# Altium schematic sheet DC_IN.SchDoc
size B
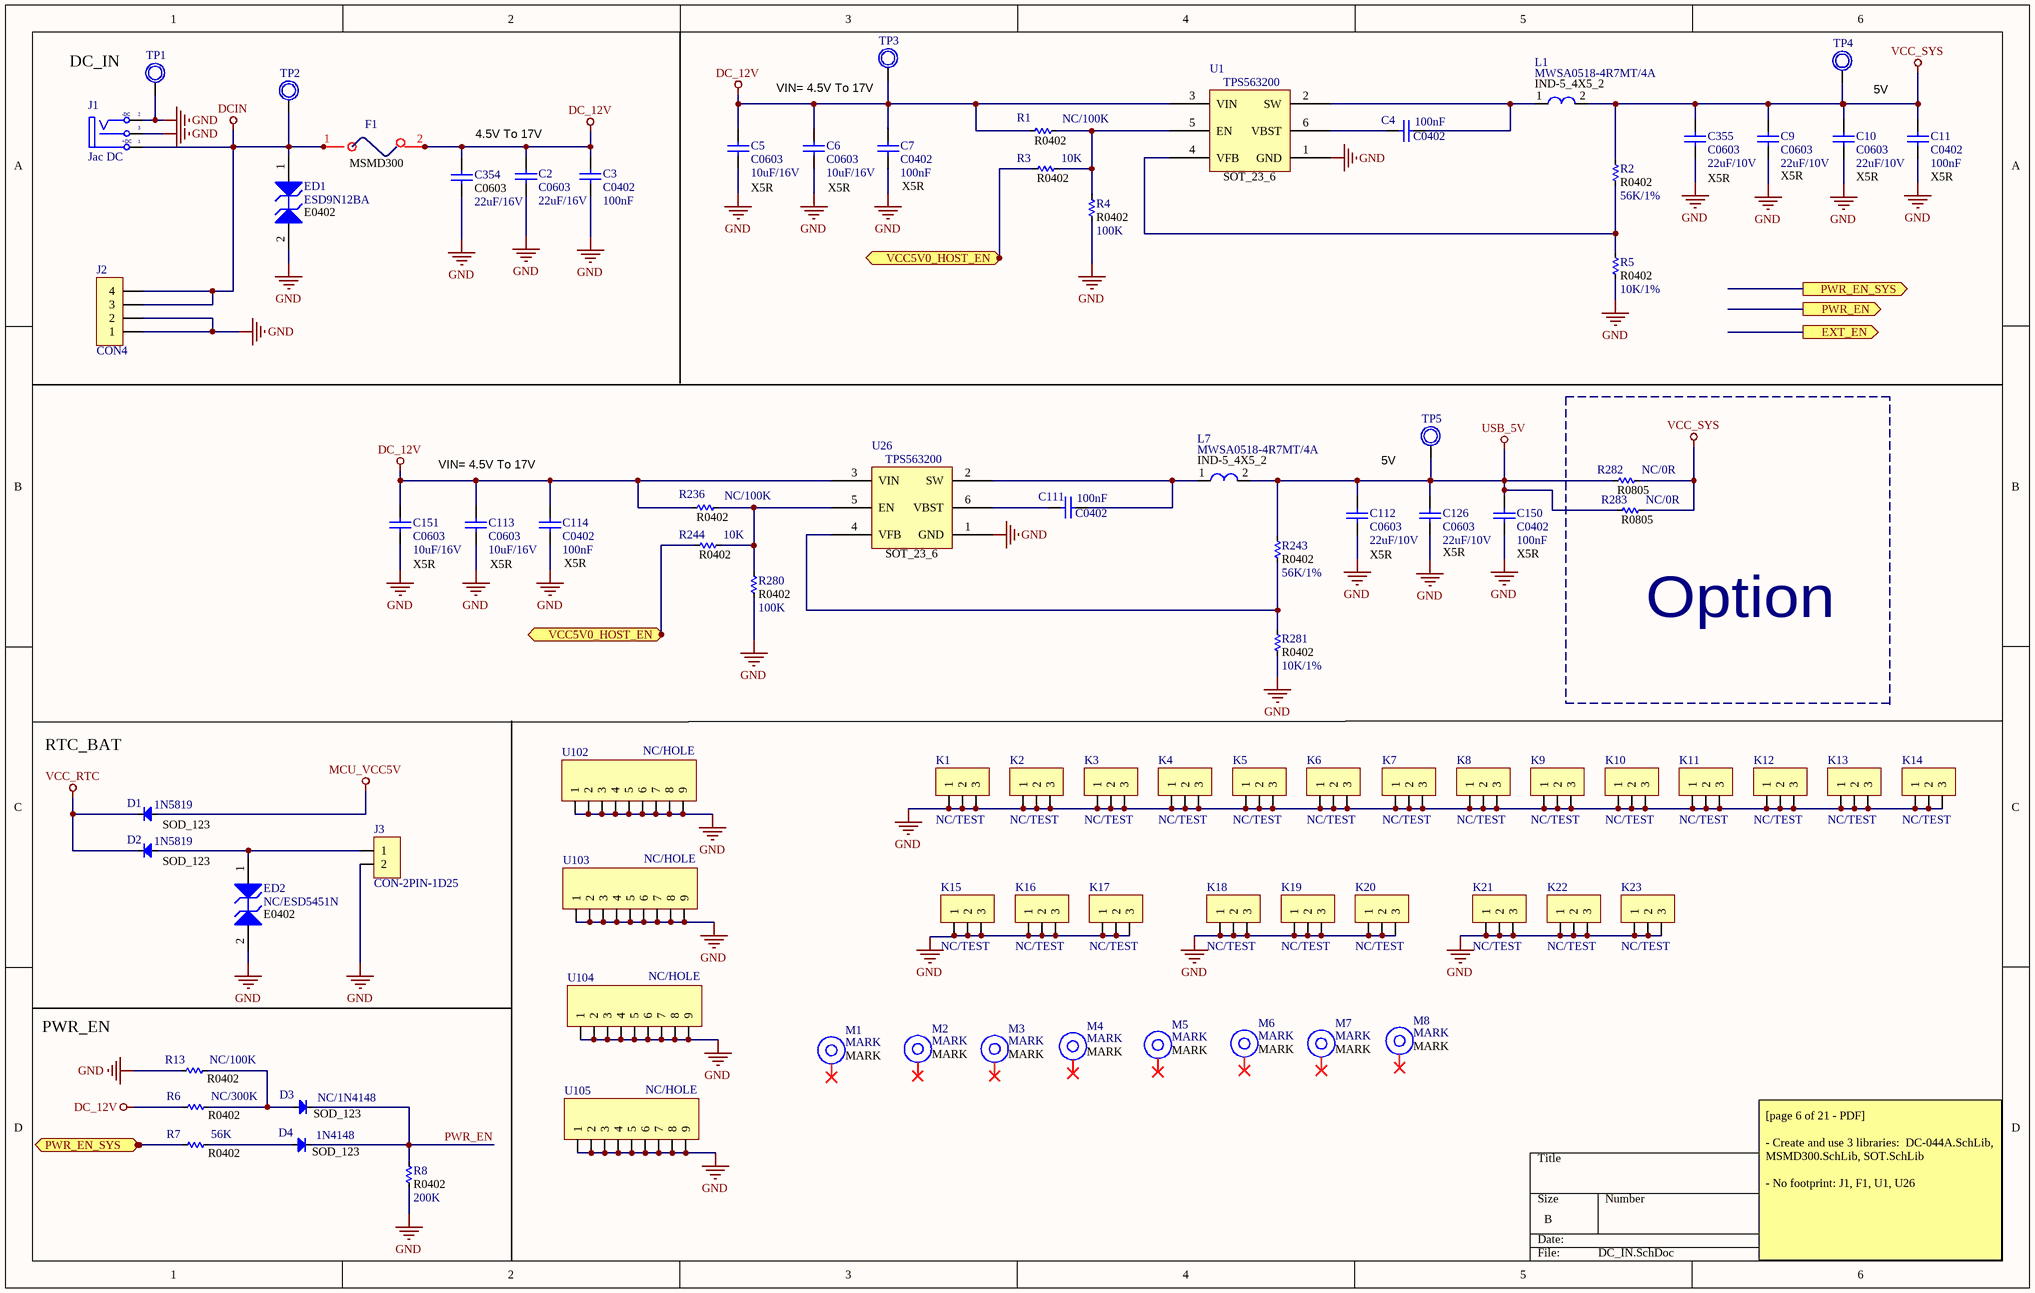
[diagram p0: DC_IN.SchDoc]

## Parts
C2  C0603  value 22uF/16V  [C 0603]
C3  C0402  value 100nF  [C 0402]
C4  C0402  value 100nF  [C 0402]
C5  C0603  value 10uF/16V  [C 0603]
C6  C0603  value 10uF/16V  [C 0603]
C7  C0402  value 100nF  [C 0402]
C9  C0603  value 22uF/10V  [C 0603]
C10  C0603  value 22uF/10V  [C 0603]
C11  C0402  value 100nF  [C 0402]
C111  C0402  value 100nF  [C 0402]
C112  C0603  value 22uF/10V  [C 0603]
C113  C0603  value 10uF/16V  [C 0603]
C114  C0402  value 100nF  [C 0402]
C126  C0603  value 22uF/10V  [C 0603]
C150  C0402  value 100nF  [C 0402]
C151  C0603  value 10uF/16V  [C 0603]
C354  C0603  value 22uF/16V  [C 0603]
C355  C0603  value 22uF/10V  [C 0603]
D1  value 1N5819  typr: SOD_123  [DIO-SMD-123]  (hidden comment: Diode SMD)
D2  value 1N5819  typr: SOD_123  [DIO-SMD-123]  (hidden comment: Diode SMD)
D3  value NC/1N4148  typr: SOD_123  [DIO-SMD-123]  (hidden comment: Diode SMD)
D4  value 1N4148  typr: SOD_123  [DIO-SMD-123]  (hidden comment: Diode SMD)
ED1  ESD9N12BA  size: E0402  [DFN1006-2L]
ED2  NC/ESD5451N  size: E0402  [DFN1006-2L]
F1  mSMD300  [MSMD300/3A]  (value not drawn)
J1  Jac DC  [DC-IN]
J2  CON4  [CON4]
J3  CON-2PIN-1D25  [Header2]
K1  NC/TEST  [KTest]
K2  NC/TEST  [KTest]
K3  NC/TEST  [KTest]
K4  NC/TEST  [KTest]
K5  NC/TEST  [KTest]
K6  NC/TEST  [KTest]
K7  NC/TEST  [KTest]
K8  NC/TEST  [KTest]
K9  NC/TEST  [KTest]
K10  NC/TEST  [KTest]
K11  NC/TEST  [KTest]
K12  NC/TEST  [KTest]
K13  NC/TEST  [KTest]
K14  NC/TEST  [KTest]
K15  NC/TEST  [KTest]
K16  NC/TEST  [KTest]
K17  NC/TEST  [KTest]
K18  NC/TEST  [KTest]
K19  NC/TEST  [KTest]
K20  NC/TEST  [KTest]
K21  NC/TEST  [KTest]
K22  NC/TEST  [KTest]
K23  NC/TEST  [KTest]
L1  MWSA0518-4R7MT/4A  [L-SMD-M-7.3x4.5]
L7  MWSA0518-4R7MT/4A  [L-SMD-M-7.3x4.5]
M1  MARK  (value not drawn)
M2  MARK  (value not drawn)
M3  MARK  (value not drawn)
M4  MARK  (value not drawn)
M5  MARK  (value not drawn)
M6  MARK  (value not drawn)
M7  MARK  (value not drawn)
M8  MARK  (value not drawn)
R1  R0402  value NC/100K  [R 0402]
R2  R0402  value 56K/1%  [R 0402]
R3  R0402  value 10K  [R 0402]
R4  R0402  value 100K  [R 0402]
R5  R0402  value 10K/1%  [R 0402]
R6  R0402  value NC/300K  [R 0402]
R7  R0402  value 56K  [R 0402]
R8  R0402  value 200K  [R 0402]
R13  R0402  value NC/100K  [R 0402]
R236  R0402  value NC/100K  [R 0402]
R243  R0402  value 56K/1%  [R 0402]
R244  R0402  value 10K  [R 0402]
R280  R0402  value 100K  [R 0402]
R281  R0402  value 10K/1%  [R 0402]
R282  R0805  value NC/0R  [R 0805]
R283  R0805  value NC/0R  [R 0805]
TP1  TP  [TP1]  (value not drawn)
TP2  TP  [TP1]  (value not drawn)
TP3  TP  [TP1]  (value not drawn)
TP4  TP  [TP1]  (value not drawn)
TP5  TP  [TP1]  (value not drawn)
U1  SOT-23-6_TPS563200  [SOT-23-6]  (value not drawn)
U26  SOT-23-6_TPS563200  [SOT-23-6]  (value not drawn)
U102  NC/HOLE  [JP9-C1T]
U103  NC/HOLE  [JP9-C1T]
U104  NC/HOLE  [JP9-C1T]
U105  NC/HOLE  [JP9-C1T]

## Blocks framed on the sheet
Option: R282 R283

## Ports
EXT_EN (out), PWR_EN (out), PWR_EN_SYS (in), PWR_EN_SYS (out), VCC5V0_HOST_EN (in)

## Nets
DC_12V: C2.2 C3.2 C5.2 C6.2 C7.2 C113.2 C114.2 C151.2 C354.2 F1.2 R1.2 R6.2 R236.2 TP3.1 U1.3(VIN) U26.3(VIN)
DCIN: ED1.1(A1) F1.1 J1.1(T) J2.3 J2.4 TP2.1
GND: C2.1 C3.1 C5.1 C6.1 C7.1 C9.1 C10.1 C11.1 C112.1 C113.1 C114.1 C126.1 C150.1 C151.1 C354.1 C355.1 ED1.2(A2) ED2.2(A2) J1.2(TN) J1.3(S) J2.1 J2.2 J3.2 K1.1 K1.2 K1.3 K2.1 K2.2 K2.3 K3.1 K3.2 K3.3 K4.1 K4.2 K4.3 K5.1 K5.2 K5.3 K6.1 K6.2 K6.3 K7.1 K7.2 K7.3 K8.1 K8.2 K8.3 K9.1 K9.2 K9.3 K10.1 K10.2 K10.3 K11.1 K11.2 K11.3 K12.1 K12.2 K12.3 K13.1 K13.2 K13.3 K14.1 K14.2 K14.3 K15.1 K15.2 K15.3 K16.1 K16.2 K16.3 K17.1 K17.2 K17.3 K18.1 K18.2 K18.3 K19.1 K19.2 K19.3 K20.1 K20.2 K20.3 K21.1 K21.2 K21.3 K22.1 K22.2 K22.3 K23.1 K23.2 K23.3 R4.1 R5.2 R8.2 R13.2 R280.1 R281.2 TP1.1 U1.1(GND) U26.1(GND) U102.1 U102.2 U102.3 U102.4 U102.5 U102.6 U102.7 U102.8 U102.9 U103.1 U103.2 U103.3 U103.4 U103.5 U103.6 U103.7 U103.8 U103.9 U104.1 U104.2 U104.3 U104.4 U104.5 U104.6 U104.7 U104.8 U104.9 U105.1 U105.2 U105.3 U105.4 U105.5 U105.6 U105.7 U105.8 U105.9
MCU_VCC5V: D1.1(A)
USB_5V: C112.2 C126.2 C150.2 L7.2 R243.2 R282.2 R283.2 TP5.1
VCC_RTC: D1.2(K) D2.2(K)
VCC_SYS: C9.2 C10.2 C11.2 C355.2 L1.2 R2.2 R282.1 R283.1 TP4.1
PWR_EN: D3.2(K) D4.2(K) R8.1
PWR_EN_SYS: R7.2 ; port PWR_EN_SYS
NetC4_1: C4.1 L1.1 U1.2(SW)
NetC4_2: C4.2 U1.6(VBST)
NetC111_1: C111.1 L7.1 U26.2(SW)
NetC111_2: C111.2 U26.6(VBST)
NetD2_1: D2.1(A) ED2.1(A1) J3.1
NetD3_1: D3.1(A) R6.1 R13.1
NetD4_1: D4.1(A) R7.1
NetR1_1: R1.1 R3.1 R4.2 U1.5(EN)
NetR2_1: R2.1 R5.1 U1.4(VFB)
NetR236_1: R236.1 R244.1 R280.2 U26.5(EN)
NetR243_1: R243.1 R281.1 U26.4(VFB)

Not connected (* = marked no-connect by the designer): M1 52*; M2 52*; M3 52*; M4 52*; M5 52*; M6 52*; M7 52*; M8 52*; R3 2; R244 2

## Notes on the sheet
- (near TP1) DC_IN
- (near TP3) VIN= 4.5V To 17V
- 5V
- 4.5V To 17V
- VIN= 4.5V To 17V
- (near TP5) 5V
- (near D1) RTC_BAT
- (near R13) PWR_EN
- [page 6 of 21 - PDF]
  - Create and use 3 libraries:  DC-044A.SchLib, MSMD300.SchLib, SOT.SchLib
  - No footprint: J1, F1, U1, U26
- (in symbol Cap) X5R
- (in symbol DCIN) -DC; +DC
- (in symbol L-SMD-1) IND-5_4X5_2
- (in symbol mSMD300) MSMD300
- (in symbol SOT-23-6_TPS563200) SOT_23_6

## Library data of the parts
C2-C7 C9-C11 C111-C114 C126 C150 C151 C354 C355 = Cap: Capacitor; Published: 8-Jun-2000; LatestRevisionDate: 17-Jul-2002; LatestRevisionNote: Re-released for DXP Platform.; PackageReference: RAD-0.3; Publisher: Altium Limited; PackageDescription: Radial Cap, Thru-Hole; 2 Leads; 0.3 in Pin Spacing
D1-D4 = Diode SMD: Default Diode; Code - JEDEC: DO-214-AB; Published: 8-Jun-2000; Revision: July-2002: Re-released for DXP Platform.; Publisher: Altium Limited
ED1 ED2 = 1SMB54CAT3: 600 W Peak Power Zener Transient Voltage Suppressor, Bidirectional, 2-Pin SMB, Tape and Reel; Manufacturer: On Semiconductor; IR Max (uA): 5; PPK Max (W): 600; V(BR) Typ (V): 63.16; DatasheetVersion: Rev. A; PackageVersion: Rev. A, 01/2000; PackageReference: SMB-2-403C-01; PackageDescription: 2-Pin Small Molded Package, J-Bend Lead, Body 4.315 x 3.555 mm; Supplier 1: Digi-Key; Supplier Part Number 1: 1SMB54CAT3-ND; Direction: Bidirectional; Packing: Tape and Reel; Mounting Technology: Surface Mount; PartNumber: 1SMB54CAT3; ComponentLink1Description: Manufacturer URL; ComponentLink1URL: http://www.onsemi.com/; ComponentLink2Description: Datasheet; ComponentLink2URL: http://www.onsemi.com/pub_link/Collateral/1SMB10CAT3-D.PDF; ComponentLink3Description: Package Specification; ComponentLink3URL: http://www.onsemi.com/pub_link/Collateral/1SMB10CAT3-D.PDF
J1 = DCIN: Jac DC input; Value: Jac DC
J2 = JP4x1-2.0: WR-PHD 2.00 mm Socket Header; Manufacturer: W¨¹rth Elektronik eiSos GmbH; partNo: 62000411821; ComponentLink1 Description: Manufacturer; ComponentLink2 Description: Datasheet; NoPins: 04; Created Date: 2 April 2013; ComponentLink1URL: http://www.we-online.com; ComponentLink2URL: http://katalog.we-online.de/em/datasheet/6200xx11821.pdf; Created by: Karrer Zheng
J3 = JP2: WR-PHD 2.54 mm Angled Socket Header; Manufacturer: W¨¹rth Elektronik eiSos GmbH; partNo: 613002143121; ComponentLink1 Description: Manufacturer; ComponentLink2 Description: Datasheet; NoPins: 02; Created Date: 29 March 2013; ComponentLink1URL: http://www.we-online.com; ComponentLink2URL: http://katalog.we-online.de/em/datasheet/6130xx143121.pdf; Created by: Karrer Zheng
K1-K23 = JP3: WR-PHD 2.54 mm Angled Socket Header; Manufacturer: W¨¹rth Elektronik eiSos GmbH; partNo: 613003143121; ComponentLink1 Description: Manufacturer; ComponentLink2 Description: Datasheet; NoPins: 03; Created Date: 29 March 2013; ComponentLink1URL: http://www.we-online.com; ComponentLink2URL: http://katalog.we-online.de/em/datasheet/6130xx143121.pdf; Created by: Karrer Zheng
L1 L7 = L-SMD-1: partNo: 78477010; Manufacturer: Wurth Elektronik; Inductance: 1.0 μH; ComponentLink1Description: Manufacturer; ComponentLink1URL: http://www.we-online.de; Created by: Baojun Chen; Created Date: Nov.2015; ComponentLink2Description: Datasheet; ComponentLink2URL: http://katalog.we-online.de/pbs/datasheet/78477010.pdf
R1-R8 R13 R236 R243 R244 R280-R283 = Res-SMD: Resistor; Manufacturer: Generic Components; Class: Passive; Published: 08/06/2000; Publisher: Altium Hobart Technology Centre
TP1-TP5 = TP1: Test Point; Value: Test Point
U1 U26 = SOT-23-6_TPS563200: Switching Voltage Regulators 17 Vin,3A Sync SD Reg; Manufacturer: Texas Instruments; Manufacturer Part Number: TPS563200DDCR; Operating Supply Current: 190 uA; Supplier 1: Mouser; RoHS: RoHS Compliant; Category: Switching Voltage Regulators; Stock 1: 18637; Pricing 1: 1=1.44, 10=1.23, 100=0.947, 500=0.836, 1000=0.660, 3000=0.586, 9000=0.564 (USD); Height: 1.1 mm; Length: 2.9 mm; Operating Temperature Range: - 40 C to + 125 C; Package / Case: SOT-23-Thin-6; Packaging: Cut Tape; Series: TPS563200; Width: 1.6 mm; Brand: Texas Instruments; Mounting Style: SMD/SMT; Maximum Operating Temperature: + 125 C; Minimum Operating Temperature: - 40 C; Product Type: Switching Voltage Regulators; Standard Pack Qty: 3000; Subcategory: PMIC - Power Management ICs; RoHS - Mouser: Y; Minimum Order Quantity: 1; Reeling: True
U102-U105 = JP9: WR-PHD 2.54 mm Angled Socket Header; Manufacturer: W¨¹rth Elektronik eiSos GmbH; partNo: 613009143121; ComponentLink1 Description: Manufacturer; ComponentLink2 Description: Datasheet; NoPins: 09; Created Date: 29 March 2013; ComponentLink1URL: http://www.we-online.com; ComponentLink2URL: http://katalog.we-online.de/em/datasheet/6130xx143121.pdf; Created by: Karrer Zheng